# EAGLE schematic dogeversity (EAGLE 6.5.0)
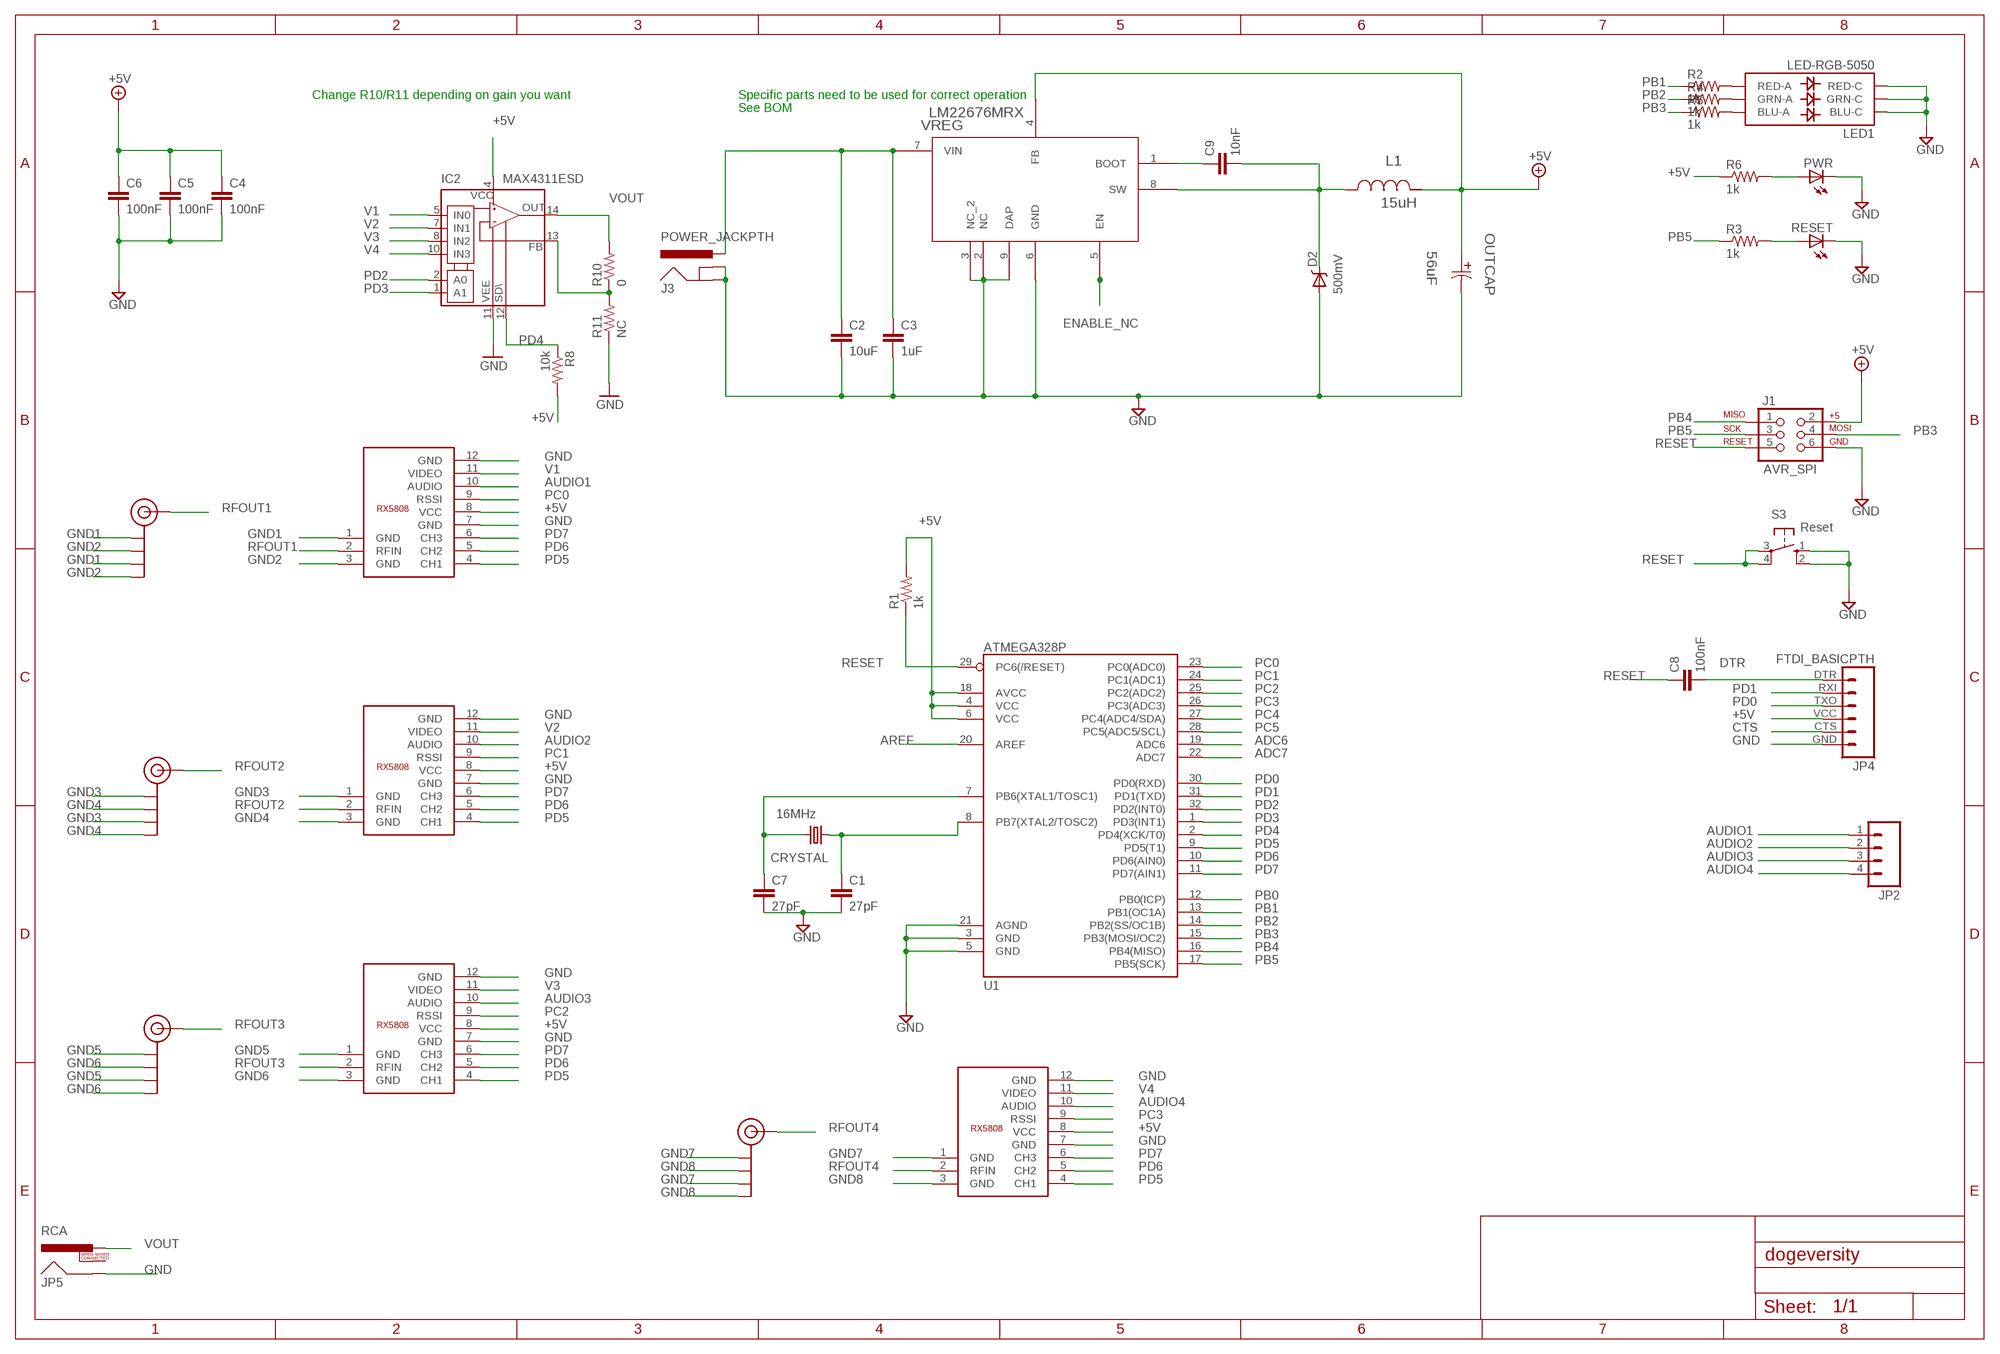
[diagram p0: schematic, sheet 1]

## Parts
`1  RX5808  [RX5808]
`2  RX5808  [RX5808]
`3  RX5808  [RX5808]
`4  RX5808  [RX5808]
C1  27pF  CAP0603-CAP  [0603-CAP]
C2  10uF  CAP1206  [1206]
C3  1uF  CAP0603-CAP  [0603-CAP]
C4  100nF  CAP0603-CAP  [0603-CAP]
C5  100nF  CAP0603-CAP  [0603-CAP]
C6  100nF  CAP0603-CAP  [0603-CAP]
C7  27pF  CAP0603-CAP  [0603-CAP]
C8  100nF  CAP0603-CAP  [0603-CAP]
C9  10nF  CAP0805  [0805]
CRYSTAL  16MHz  CRYSTALTXC-7A  [CRYSTAL-TXC-7A]
D2  500mV  DIODE-SCHOTTKY_  [SMA-DIODE]
IC2  MAX4311ESD  [SO14]
J1  AVR_SPI  AVR_SPI_PRG_6NS  [2X3-NS]
J3  POWER_JACKPTH  [POWER_JACK_PTH]
J$1  SMA_EDGE  [SMA-EDGE]
J$2  SMA_EDGE  [SMA-EDGE]
J$4  SMA_EDGE  [SMA-EDGE]
J$5  SMA_EDGE  [SMA-EDGE]
JP2  M04PTH  [1X04]
JP4  FTDI_BASICPTH  [FTDI_BASIC]
JP5  RCA  [RCA]
L1  15uH  XAL5050-153MEB  [XAL5050]
LED1  LED-RGB-5050  LED-TRICOLOR-5050NO_IC  [LED-TRICOLOR-5050]
OUTCAP  56uF  20SVPF56MX  [PCAP_SVP_B6]
PWR  LED-YELLOW0603  [LED-0603]
R1  1k  RESISTOR0603  [0603-RES]
R2  1k  RESISTOR0603  [0603-RES]
R3  1k  RESISTOR0603  [0603-RES]
R4  1k  RESISTOR0603  [0603-RES]
R5  1k  RESISTOR0603  [0603-RES]
R6  1k  RESISTOR0603  [0603-RES]
R8  10k  RESISTOR0603  [0603-RES]
R10  0  RESISTOR0603  [0603-RES]
R11  NC  RESISTOR0603  [0603-RES]
RESET  LED-YELLOW0603  [LED-0603]
S3  Reset  10-XX  [B3F-10XX]
U1  ATMEGA328P  ATMEGA328_SMT  [TQFP32-08]
VREG  LM22676MRX  [MRA08B]

## Nets
12V [+5V]: C2.1 C3.1 J3.PWR VREG.7(VIN)
+5V [+5V]: `1.8(VCC) `2.8(VCC) `3.8(VCC) `4.8(VCC) C4.1 C5.1 C6.1 IC2.4(V+) J1.2 JP4.VCC L1.1 OUTCAP.1 R1.2 R6.1 R8.2 U1.4(VCC) U1.6(VCC) U1.18(AVCC) VREG.4(FB)
ADC6: U1.19(ADC6)
ADC7: U1.22(ADC7)
AREF: U1.20(AREF)
AUDIO1: `1.10(AUDIO) JP2.1
AUDIO2: `2.10(AUDIO) JP2.2
AUDIO3: `3.10(AUDIO) JP2.3
AUDIO4: `4.10(AUDIO) JP2.4
CTS: JP4.CTS
DTR: C8.2 JP4.DTR
ENABLE_NC: VREG.5(EN)
FB: IC2.13(FB) R10.1 R11.2
GND [Ground]: `1.7(GND) `1.12(GND) `2.7(GND) `2.12(GND) `3.7(GND) `3.12(GND) `4.7(GND) `4.12(GND) C1.2 C2.2 C3.2 C4.2 C5.2 C6.2 C7.2 D2.A IC2.11(V-) J1.6 J3.GND J3.GNDBREAK JP4.GND JP5.SHELL LED1.4(BLU-C) LED1.5(RED-C) LED1.6(GRN-C) OUTCAP.2 PWR.C R11.1 RESET.C S3.1(S) S3.2(S1) U1.3(GND) U1.5(GND) U1.21(AGND) VREG.2(NC) VREG.3(NC_2) VREG.6(GND) VREG.9(DAP)
GND1: `1.1(GND) J$1.GND@0(GND) J$1.GND@2(GND)
GND2: `1.3(GND) J$1.GND@1(GND) J$1.GND@3(GND)
GND3: `2.1(GND) J$4.GND@0(GND) J$4.GND@2(GND)
GND4: `2.3(GND) J$4.GND@1(GND) J$4.GND@3(GND)
GND5: `3.1(GND) J$5.GND@0(GND) J$5.GND@2(GND)
GND6: `3.3(GND) J$5.GND@1(GND) J$5.GND@3(GND)
GND7: `4.1(GND) J$2.GND@0(GND) J$2.GND@2(GND)
GND8: `4.3(GND) J$2.GND@1(GND) J$2.GND@3(GND)
N$2: C1.1 CRYSTAL.P$1 U1.8(PB7(XTAL2/TOSC2))
N$3: C7.1 CRYSTAL.P$2 U1.7(PB6(XTAL1/TOSC1))
N$5: LED1.2(RED-A) R2.2
N$6: LED1.1(GRN-A) R4.2
N$8: PWR.A R6.2
N$10: C9.1 VREG.1(BOOT)
N$11: R3.2 RESET.A
N$14: LED1.3(BLU-A) R5.2
PB0: U1.12(PB0(ICP))
PB1: R2.1 U1.13(PB1(OC1A))
PB2: R4.1 U1.14(PB2(SS/OC1B))
PB3: J1.4 R5.1 U1.15(PB3(MOSI/OC2))
PB4: J1.1 U1.16(PB4(MISO))
PB5: J1.3 R3.1 U1.17(PB5(SCK))
PC0: `1.9(RSSI) U1.23(PC0(ADC0))
PC1: `2.9(RSSI) U1.24(PC1(ADC1))
PC2: `3.9(RSSI) U1.25(PC2(ADC2))
PC3: `4.9(RSSI) U1.26(PC3(ADC3))
PC4: U1.27(PC4(ADC4/SDA))
PC5: U1.28(PC5(ADC5/SCL))
PD0: JP4.TXO U1.30(PD0(RXD))
PD1: JP4.RXI U1.31(PD1(TXD))
PD2: IC2.2(A0) U1.32(PD2(INT0))
PD3: IC2.1(A1) U1.1(PD3(INT1))
PD4: IC2.12(!SHDN) R8.1 U1.2(PD4(XCK/T0))
PD5: `1.4(CH1) `2.4(CH1) `3.4(CH1) `4.4(CH1) U1.9(PD5(T1))
PD6: `1.5(CH2) `2.5(CH2) `3.5(CH2) `4.5(CH2) U1.10(PD6(AIN0))
PD7: `1.6(CH3) `2.6(CH3) `3.6(CH3) `4.6(CH3) U1.11(PD7(AIN1))
RESET: C8.1 J1.5 R1.1 S3.3(P) S3.4(P1) U1.29(PC6(/RESET))
RFOUT1: `1.2(RFIN) J$1.SIG(SIGNAL)
RFOUT2: `2.2(RFIN) J$4.SIG(SIGNAL)
RFOUT3: `3.2(RFIN) J$5.SIG(SIGNAL)
RFOUT4: `4.2(RFIN) J$2.SIG(SIGNAL)
SW [+5V]: C9.2 D2.C L1.2 VREG.8(SW)
V1: `1.11(VIDEO) IC2.5(IN0)
V2: `2.11(VIDEO) IC2.7(IN1)
V3: `3.11(VIDEO) IC2.8(IN2)
V4: `4.11(VIDEO) IC2.10(IN3)
VOUT: IC2.14(OUT) JP5.PIN R10.2
Unconnected: JP5.SWITCH

## Notes on the sheet
- Change R10/R11 depending on gain you want | Specific parts need to be used for correct operation
- See BOM

## Library data of the parts
`1-`4 = rx5808:RX5808
C1 C4-C7 = SparkFun-Passives:CAP: Capacitor Standard 0603 ceramic capacitor, and 0.1" leaded capacitor.
C2 C3 C8 C9 = SparkFun-Capacitors:CAP: Capacitor Standard 0603 ceramic capacitor, and 0.1" leaded capacitor.
CRYSTAL = SparkFun-FreqCtrl:CRYSTAL: Various standard crystals. Proven footprints. Spark Fun Electronics SKU : COM-00534
D2 = SparkFun-DiscreteSemi:DIODE-SCHOTTKY: Commonly MBRA140.
IC2 = maxim:MAX4311: Video Multiplexer-Amplifier High-Speed, Low-Power, Single-Supply, Multichannel; MF: MAXIM; MPN: MAX4311ESD+; OC_FARNELL: unknown; OC_NEWARK: 37K7965
J1 = SparkFun:AVR_SPI_PRG_6: AVR ISP 6 Pin This is the reduced ISP connector for AVR programming. Common on Arduino. This footprint will take up less PCB space and can be used with a 10-pin to 6-pin adapter such as SKU: BOB-08508
J3 = SparkFun-Connectors:POWER_JACK: Power Jack This is the standard 5.5mm barrel jack for power. The PTH is the most common, proven, reliable, footprint. The Slot footprint only works if the mill layer is transmitted to the PCB fab house so be warned. Mating wall wart : TOL-00298 (and others); PROD_ID: PRT-00119
J$1 J$2 J$4 J$5 = SparkFun-Connectors:SMA_EDGE: SMA Antenna Connector End launch SMA connector. The paste layer has been removed so that the connector can be hand soldered onto the board after reflow.
JP2 = SparkFun-Connectors:M04: Header 4 Standard 4-pin 0.1" header. Use with straight break away headers (SKU : PRT-00116), right angle break away headers (PRT-00553), swiss pins (PRT-00743), machine pins (PRT-00117), and female headers (PRT-00115). Molex polarized connector foot print use with SKU : PRT-08231 with associated crimp pins and housings. 1MM SMD Version SKU: PRT-10208
JP4 = SparkFun-Connectors:FTDI_BASIC: FTDI Basic header with labels
JP5 = SparkFun-Connectors:RCA
L1 = simpleswitch:XAL5050-153MEB; DCR: 0.08; IDC: 3.7; L: 1.5E-5; MANUFACTURER_NAME: Coilcraft; MANUFACTURER_PART_NUMBER: XAL5050-153MEB; VENDOR: Coilcraft
LED1 = SparkFun-LED:LED-TRICOLOR-5050
OUTCAP = simpleswitch:20SVPF56MX
PWR RESET = SparkFun-LED:LED-YELLOW: Yellow SMD LEDs LilyPad 1206- DIO-09909 0603- DIO-09003; PROD_ID: DIO-09003
R1-R6 R8 R10 R11 = SparkFun-Resistors:RESISTOR: Resistor Basic schematic elements and footprints for 0603, 1206, and PTH resistors.
S3 = switch-omron:10-XX: OMRON SWITCH; MPN: B3F-1000; OC_FARNELL: 176432; OC_NEWARK: 36M3542
U1 = SparkFun-DigitalIC:ATMEGA328_SMT: 32-Pin Atmega328 part Commonly used on Arduino compatible boards Available in QFP and QFN packages TQFP is IC-09069 QFN is non-stock; PROD_ID: IC-09069
VREG = simpleswitch:LM22676MRX

## Net classes
0 default: width 0.254 mm
1 Ground: width 0.381 mm
2 +5V: width 0.381 mm